# Altium schematic sheet digital_gpio.SchDoc
size 701 x 447 mm
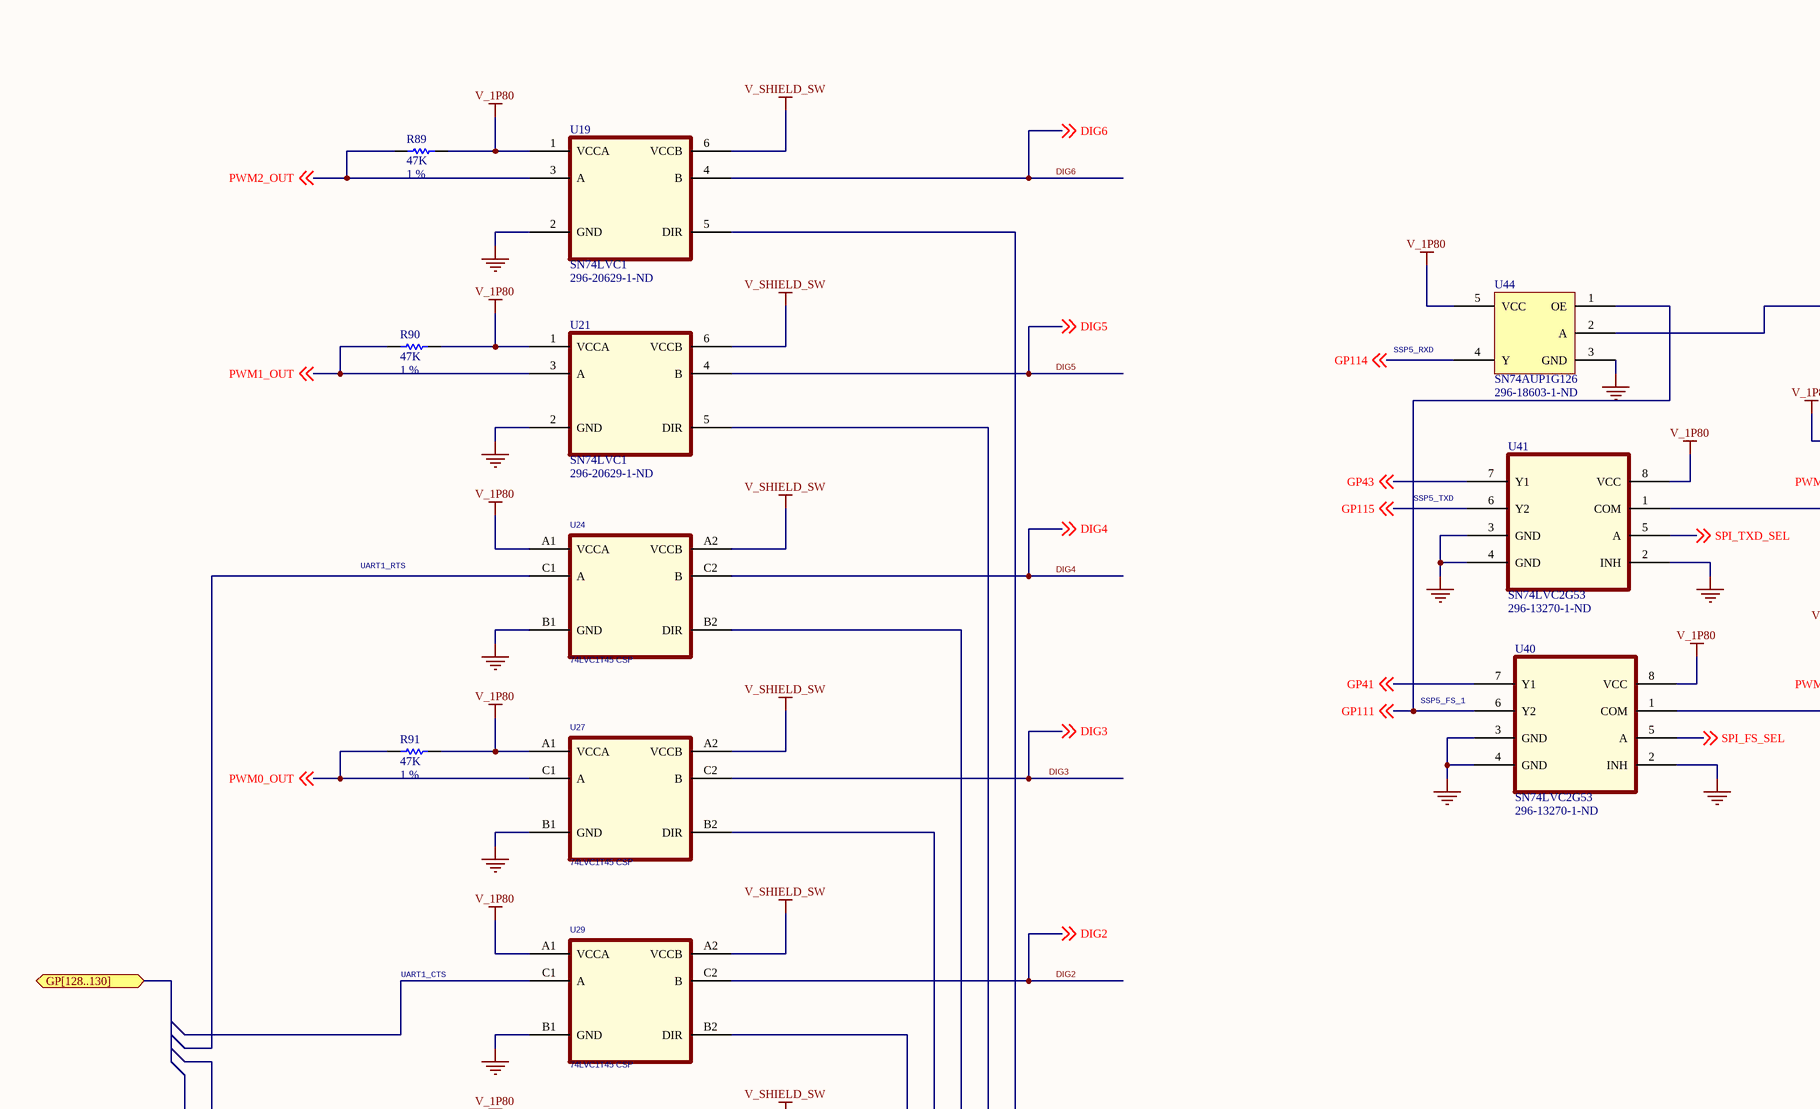
[diagram p0: digital_gpio.SchDoc, top left]
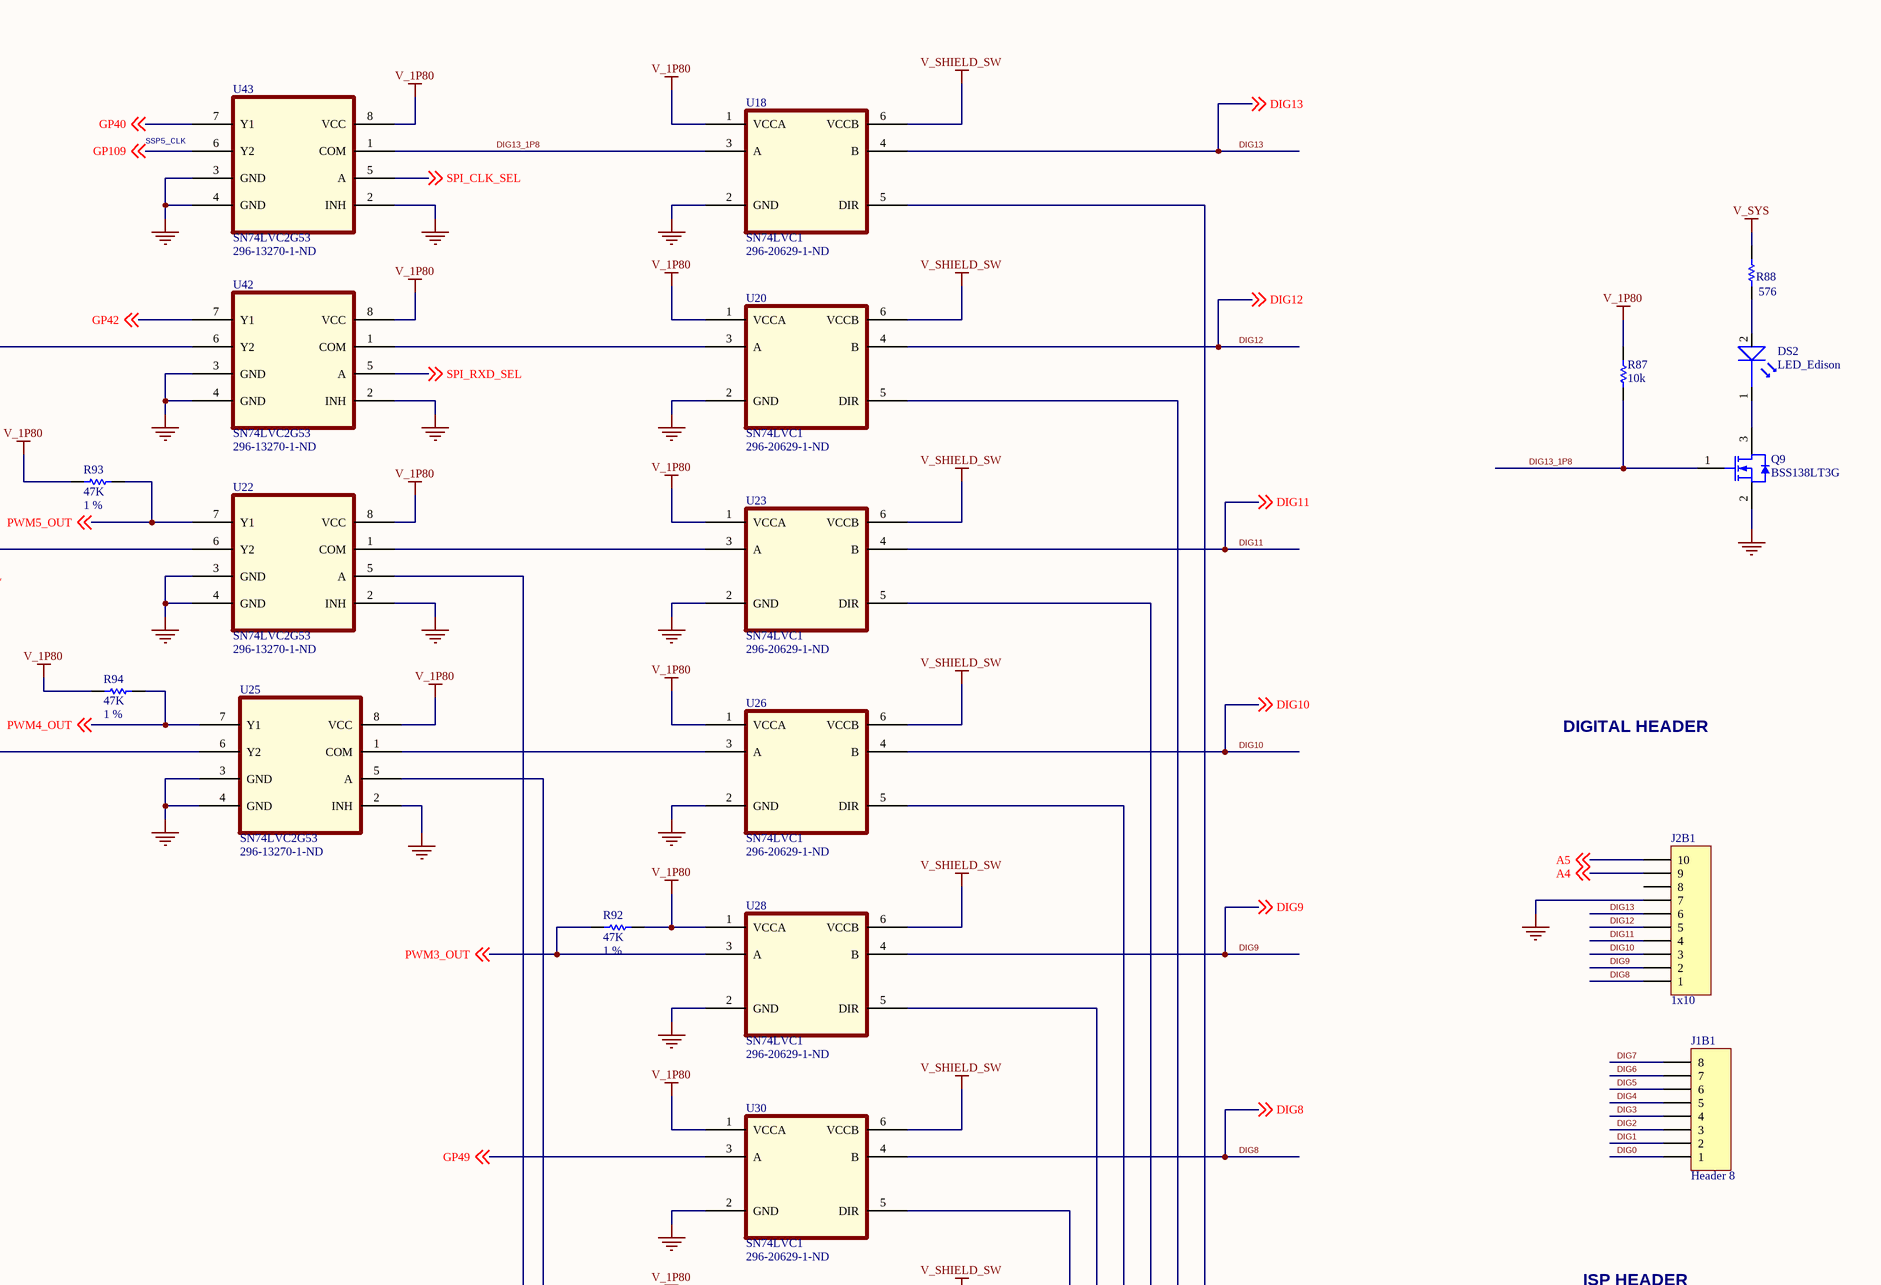
[diagram p1: digital_gpio.SchDoc, top right]
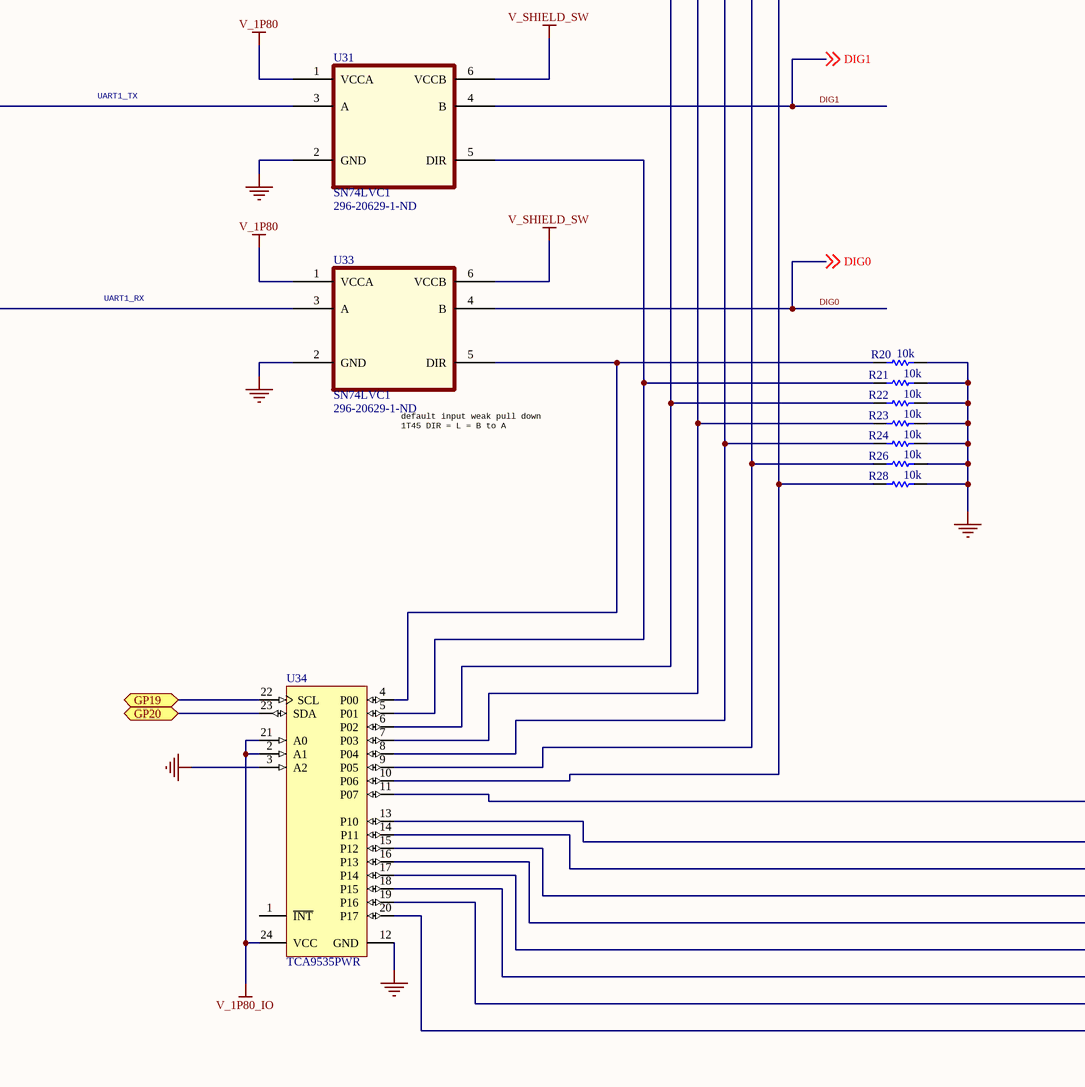
[diagram p2: digital_gpio.SchDoc, bottom left]
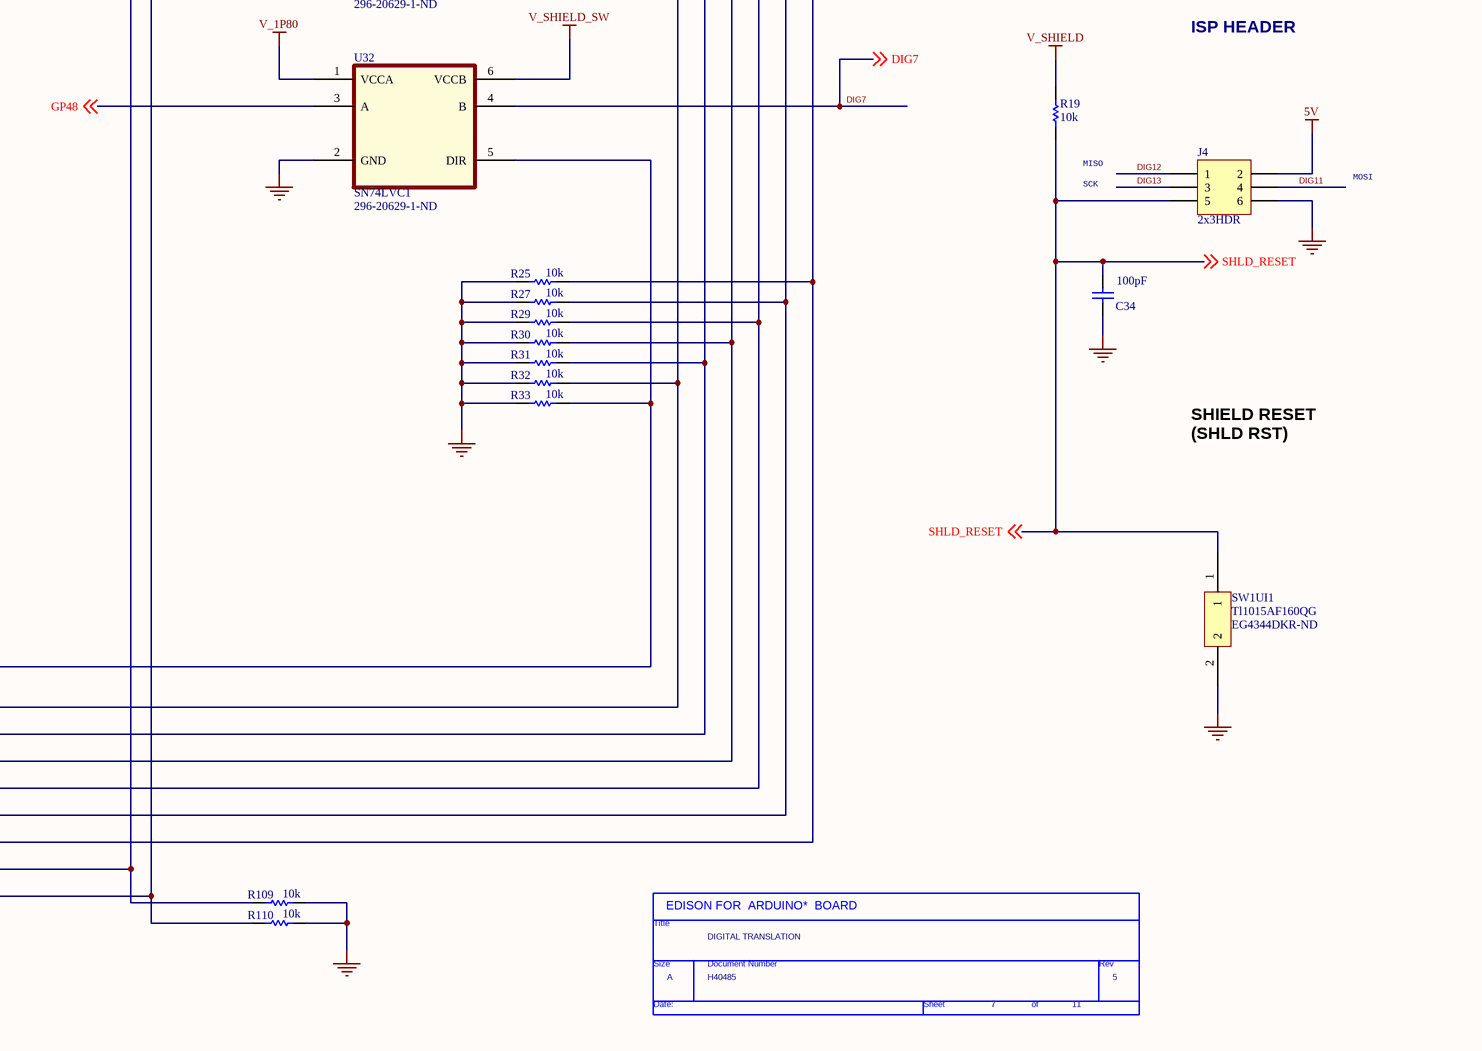
[diagram p3: digital_gpio.SchDoc, bottom right]

## Parts
*  Page Count: 11  Page Number: 7  Page Size: A  Title: DIGITAL TRANSLATION  RevCode: 5  Doc: H40485  (hidden comment: TitleBlock0)  (graphical)
C34  value 100pF  [CAPC0201(0603)33_N]  (hidden comment: CAP 100pF 25V 0201(0603))
DS2  LED_Edison  [LTST-C281KGKT]
J1B1  Header 8  [HDR1X8]
J2B1  1x10  [HDR1X10]
J4  2x3HDR  [HDR2X3]
Q9  BSS138LT3G  [ONSC-SOT-23-3-318-08_V]
R19  value 10k  [RESC0201(0603)_M]  (hidden comment: 165R 1% 0201(0603))
R20  value 10k  [RESC0201(0603)_M]  (hidden comment: 165R 1% 0201(0603))
R21  value 10k  [RESC0201(0603)_M]  (hidden comment: 165R 1% 0201(0603))
R22  value 10k  [RESC0201(0603)_M]  (hidden comment: 165R 1% 0201(0603))
R23  value 10k  [RESC0201(0603)_M]  (hidden comment: 165R 1% 0201(0603))
R24  value 10k  [RESC0201(0603)_M]  (hidden comment: 165R 1% 0201(0603))
R25  value 10k  [RESC0201(0603)_M]  (hidden comment: 165R 1% 0201(0603))
R26  value 10k  [RESC0201(0603)_M]  (hidden comment: 165R 1% 0201(0603))
R27  value 10k  [RESC0201(0603)_M]  (hidden comment: 165R 1% 0201(0603))
R28  value 10k  [RESC0201(0603)_M]  (hidden comment: 165R 1% 0201(0603))
R29  value 10k  [RESC0201(0603)_M]  (hidden comment: 165R 1% 0201(0603))
R30  value 10k  [RESC0201(0603)_M]  (hidden comment: 165R 1% 0201(0603))
R31  value 10k  [RESC0201(0603)_M]  (hidden comment: 165R 1% 0201(0603))
R32  value 10k  [RESC0201(0603)_M]  (hidden comment: 165R 1% 0201(0603))
R33  value 10k  [RESC0201(0603)_M]  (hidden comment: 165R 1% 0201(0603))
R87  value 10k  [RESC0201(0603)_M]  (hidden comment: 165R 1% 0201(0603))
R88  value 576  [RESC0402(1005)_L]  (hidden comment: 576R 1% 0402(1005))
R89  value 47K  Tolerance: 1 %  [RESC0201(0603)_N]  (hidden comment: 47K 1% 0201(0603))
R90  value 47K  Tolerance: 1 %  [RESC0201(0603)_N]  (hidden comment: 47K 1% 0201(0603))
R91  value 47K  Tolerance: 1 %  [RESC0201(0603)_N]  (hidden comment: 47K 1% 0201(0603))
R92  value 47K  Tolerance: 1 %  [RESC0201(0603)_N]  (hidden comment: 47K 1% 0201(0603))
R93  value 47K  Tolerance: 1 %  [RESC0201(0603)_N]  (hidden comment: 47K 1% 0201(0603))
R94  value 47K  Tolerance: 1 %  [RESC0201(0603)_N]  (hidden comment: 47K 1% 0201(0603))
R109  value 10k  [RESC0201(0603)_M]  (hidden comment: 165R 1% 0201(0603))
R110  value 10k  [RESC0201(0603)_M]  (hidden comment: 165R 1% 0201(0603))
SW1UI1  Tl1015AF160QG  Supplier Part Number 1: EG4344DKR-ND  [TL1015AF160QG]
U18  SN74LVC1  Supplier Part Number 1: 296-20629-1-ND  [R-PDSO-N6]
U19  SN74LVC1  Supplier Part Number 1: 296-20629-1-ND  [R-PDSO-N6]
U20  SN74LVC1  Supplier Part Number 1: 296-20629-1-ND  [R-PDSO-N6]
U21  SN74LVC1  Supplier Part Number 1: 296-20629-1-ND  [R-PDSO-N6]
U22  SN74LVC2G53  Supplier Part Number 1: 296-13270-1-ND  [S-PSDO-8]
U23  SN74LVC1  Supplier Part Number 1: 296-20629-1-ND  [R-PDSO-N6]
U24  74LVC1T45 CSP  [bga6_5mm_37x57]
U25  SN74LVC2G53  Supplier Part Number 1: 296-13270-1-ND  [S-PSDO-8]
U26  SN74LVC1  Supplier Part Number 1: 296-20629-1-ND  [R-PDSO-N6]
U27  74LVC1T45 CSP  [bga6_5mm_37x57]
U28  SN74LVC1  Supplier Part Number 1: 296-20629-1-ND  [R-PDSO-N6]
U29  74LVC1T45 CSP  [bga6_5mm_37x57]
U30  SN74LVC1  Supplier Part Number 1: 296-20629-1-ND  [R-PDSO-N6]
U31  SN74LVC1  Supplier Part Number 1: 296-20629-1-ND  [R-PDSO-N6]
U32  SN74LVC1  Supplier Part Number 1: 296-20629-1-ND  [R-PDSO-N6]
U33  SN74LVC1  Supplier Part Number 1: 296-20629-1-ND  [R-PDSO-N6]
U34  TCA9535PWR  [PW24_N]
U40  SN74LVC2G53  Supplier Part Number 1: 296-13270-1-ND  [S-PSDO-8]
U41  SN74LVC2G53  Supplier Part Number 1: 296-13270-1-ND  [S-PSDO-8]
U42  SN74LVC2G53  Supplier Part Number 1: 296-13270-1-ND  [S-PSDO-8]
U43  SN74LVC2G53  Supplier Part Number 1: 296-13270-1-ND  [S-PSDO-8]
U44  SN74AUP1G126  Supplier Part Number 1: 296-18603-1-ND  [R-PDS-N5]

## Ports
GP19 (bidir), GP20 (bidir), GP[128..130] (bidir)

## Nets
5V: J4.2
GND: C34.2 J2B1.7 J4.6 Q9.2(S) R20.1 R21.1 R22.1 R23.1 R24.1 R25.2 R26.1 R27.2 R28.1 R29.2 R30.2 R31.2 R32.2 R33.2 R109.1 R110.1 SW1UI1.2 U18.2(GND) U19.2(GND) U20.2(GND) U21.2(GND) U22.2(INH) U22.3(GND) U22.4(GND) U23.2(GND) U24.B1(GND) U25.2(INH) U25.3(GND) U25.4(GND) U26.2(GND) U27.B1(GND) U28.2(GND) U29.B1(GND) U30.2(GND) U31.2(GND) U32.2(GND) U33.2(GND) U34.3(A2) U34.12(GND) U40.2(INH) U40.3(GND) U40.4(GND) U41.2(INH) U41.3(GND) U41.4(GND) U42.2(INH) U42.3(GND) U42.4(GND) U43.2(INH) U43.3(GND) U43.4(GND) U44.3(GND)
V_1P80: R87.1 R89.1 R90.1 R91.1 R92.1 R93.2 R94.2 U18.1(VCCA) U19.1(VCCA) U20.1(VCCA) U21.1(VCCA) U22.8(VCC) U23.1(VCCA) U24.A1(VCCA) U25.8(VCC) U26.1(VCCA) U27.A1(VCCA) U28.1(VCCA) U29.A1(VCCA) U30.1(VCCA) U31.1(VCCA) U32.1(VCCA) U33.1(VCCA) U40.8(VCC) U41.8(VCC) U42.8(VCC) U43.8(VCC) U44.5(VCC)
V_1P80_IO: U34.2(A1) U34.21(A0) U34.24(VCC)
V_SHIELD: R19.1
V_SHIELD_SW: U18.6(VCCB) U19.6(VCCB) U20.6(VCCB) U21.6(VCCB) U23.6(VCCB) U24.A2(VCCB) U26.6(VCCB) U27.A2(VCCB) U28.6(VCCB) U29.A2(VCCB) U30.6(VCCB) U31.6(VCCB) U32.6(VCCB) U33.6(VCCB)
V_SYS: R88.2
A4: J2B1.9 ; off-sheet A4
A5: J2B1.10 ; off-sheet A5
DIG0: J1B1.1 U33.4(B) ; off-sheet DIG0
DIG1: J1B1.2 U31.4(B) ; off-sheet DIG1
DIG2: J1B1.3 U29.C2(B) ; off-sheet DIG2
DIG3: J1B1.4 U27.C2(B) ; off-sheet DIG3
DIG4: J1B1.5 U24.C2(B) ; off-sheet DIG4
DIG5: J1B1.6 U21.4(B) ; off-sheet DIG5
DIG6: J1B1.7 U19.4(B) ; off-sheet DIG6
DIG7: J1B1.8 U32.4(B) ; off-sheet DIG7
DIG8: J2B1.1 U30.4(B) ; off-sheet DIG8
DIG9: J2B1.2 U28.4(B) ; off-sheet DIG9
DIG10: J2B1.3 U26.4(B) ; off-sheet DIG10
DIG11: J2B1.4 J4.4 U23.4(B) ; off-sheet DIG11
DIG12: J2B1.5 J4.1 U20.4(B) ; off-sheet DIG12
DIG13: J2B1.6 J4.3 U18.4(B) ; off-sheet DIG13
DIG13_1P8: Q9.1(G) R87.2 U18.3(A) U43.1(COM)
GP19: U34.22(SCL) ; port GP19
GP20: U34.23(SDA) ; port GP20
GP40: U43.7(Y1) ; off-sheet GP40
GP41: U40.7(Y1) ; off-sheet GP41
GP42: U42.7(Y1) ; off-sheet GP42
GP43: U41.7(Y1) ; off-sheet GP43
GP48: U32.3(A) ; off-sheet GP48
GP49: U30.3(A) ; off-sheet GP49
GP109: U43.6(Y2) ; off-sheet GP109
GP111: U40.6(Y2) U44.1(OE) ; off-sheet GP111
GP114: U44.4(Y) ; off-sheet GP114
GP115: U41.6(Y2) ; off-sheet GP115
PWM0_OUT: R91.2 U27.C1(A) ; off-sheet PWM0_OUT
PWM1_OUT: R90.2 U21.3(A) ; off-sheet PWM1_OUT
PWM2_OUT: R89.2 U19.3(A) ; off-sheet PWM2_OUT
PWM3_OUT: R92.2 U28.3(A) ; off-sheet PWM3_OUT
PWM4_OUT: R94.1 U25.7(Y1) ; off-sheet PWM4_OUT
PWM5_OUT: R93.1 U22.7(Y1) ; off-sheet PWM5_OUT
SHLD_RESET: C34.1 J4.5 R19.2 SW1UI1.1 ; off-sheet SHLD_RESET
SPI_CLK_SEL: U43.5(A) ; off-sheet SPI_CLK_SEL
SPI_FS_SEL: U40.5(A) ; off-sheet SPI_FS_SEL
SPI_RXD_SEL: U42.5(A) ; off-sheet SPI_RXD_SEL
SPI_TXD_SEL: U41.5(A) ; off-sheet SPI_TXD_SEL
NetDS2_1: DS2.1(LED1) Q9.3(D)
NetDS2_2: DS2.2(LED2) R88.1
NetR20_2: R20.2 U33.5(DIR) U34.4(P00)
NetR21_2: R21.2 U31.5(DIR) U34.5(P01)
NetR22_2: R22.2 U29.B2(DIR) U34.6(P02)
NetR23_2: R23.2 U27.B2(DIR) U34.7(P03)
NetR24_2: R24.2 U24.B2(DIR) U34.8(P04)
NetR25_1: R25.1 U18.5(DIR) U34.18(P15)
NetR26_2: R26.2 U21.5(DIR) U34.9(P05)
NetR27_1: R27.1 U20.5(DIR) U34.17(P14)
NetR28_2: R28.2 U19.5(DIR) U34.10(P06)
NetR29_1: R29.1 U23.5(DIR) U34.16(P13)
NetR30_1: R30.1 U26.5(DIR) U34.15(P12)
NetR31_1: R31.1 U28.5(DIR) U34.14(P11)
NetR32_1: R32.1 U30.5(DIR) U34.13(P10)
NetR33_1: R33.1 U32.5(DIR) U34.11(P07)
NetR109_2: R109.2 U22.5(A) U34.19(P16)
NetR110_2: R110.2 U25.5(A) U34.20(P17)
NetU20_3: U20.3(A) U42.1(COM)
NetU22_1: U22.1(COM) U23.3(A)
NetU22_6: U22.6(Y2) U41.1(COM)
NetU25_1: U25.1(COM) U26.3(A)
NetU25_6: U25.6(Y2) U40.1(COM)
NetU42_6: U42.6(Y2) U44.2(A)

Not connected (* = marked no-connect by the designer): J2B1 8; U24 C1(A); U29 C1(A); U31 3(A); U33 3(A); U34 1(~{INT})

## Notes on the sheet
- (near U43) SSP5_CLK
- SSP5_RXD
- SSP5_TXD
- UART1_RTS
- DIGITAL HEADER
- SSP5_FS_1
- UART1_CTS
- UART1_TX
- ISP HEADER
- UART1_RX
- (near R19) MISO
- SCK
- MOSI
- (near U33) default input weak pull down
  1T45 DIR = L = B to A
- SHIELD RESET
  (SHLD RST)
- (in symbol TitleBlock0) EDISON FOR  ARDUINO*  BOARD; Title; Size; Document Number; Rev; Date:; Sheet; of

## Library data of the parts
C34 = CMP-1033-00493-1: CAP 100pF 25V ±5% 0201 (0603 Metric) Thickness 0.33mm SMD; Case-EIA: 0201; Case-Metric: 0603; Tolerance: ±5%; Rated Voltage: 25 V; Max Thickness: 0.33 mm; Technology: SMT; Supplier 1: Digi-Key; Supplier Part Number 1: 1276-1385-1-ND
J1B1 = Header 8: Header, 8-Pin; LatestRevisionDate: 17-Jul-2002; LatestRevisionNote: Re-released for DXP Platform.; Publisher: Altium Limited; Supplier 1: Digi-Key; Supplier Part Number 1: S7006-ND
J2B1 = Header 10: Header, 10-Pin; LatestRevisionDate: 17-Jul-2002; LatestRevisionNote: Re-released for DXP Platform.; Publisher: Altium Limited; Supplier 1: Digi-Key; Supplier Part Number 1: S7008-ND
J4 = Header 3X2: Header, 3-Pin, Dual row; LatestRevisionDate: 17-Jul-2002; LatestRevisionNote: Re-released for DXP Platform.; Publisher: Altium Limited
Q9 = CMP-1058-00765-1: Power MOSFET, 200 mA, 50 V, N-Channel, 3-Pin SOT-23, Pb-Free, Tape and Reel; Manufacturer: On Semiconductor; PD Max (W): 0.225; Channel Polarity: N Channel; Crss Typ (pF): 3.5; Configuration: Single; ID Max (A): 0.2; Ciss Typ (pF): 40; V(BR)DSS Min (V): 50; VGS(th) Max (V): 1.5; Coss Typ (pF): 12; VGS Max (V): 20; ComponentLink2URL: http://www.onsemi.com/pub_link/Collateral/BSS138LT1-D.PDF; PackageDescription: 3-Pin Small Outline Transistor, Body 2.92 x 1.3 mm, Pitch 0.95 mm; Package Type: SOT-23-3; Mounting Technology: Surface Mount; ComponentLink1Description: Manufacturer URL; PackageVersion: Rev. AP, 11/2009; ComponentLink3Description: Package Specification; DatasheetVersion: Rev. 8; RoHS: Pb-Free; Packing: Tape and Reel; PackageReference: SOT-23-3-318-08; PartNumber: BSS138LT3G; ComponentLink3URL: http://www.onsemi.cn/pub_link/Collateral/318-08.PDF; ComponentLink1URL: http://www.onsemi.com/; ComponentLink2Description: Datasheet
R19-R33 R87 R109 R110 = CMP-1010-00326-1: 165R 0.05W 1% 0201 (0603 Metric)  SMD; Case-EIA: 0201; Case-Metric: 0603; Power: 0.05 W; Tolerance: 1 %; Technology: SMT; Supplier 1: Digi-Key; Supplier Part Number 1: 311-165HRCT-ND
R88 = CMP-1011-00483-1: 576R 0.063W 1% 0402 (1005 Metric)  SMD; Case-Metric: 1005; Case-EIA: 0402; Technology: SMT; Tolerance: 1 %; Power: 0.063 W; Supplier 1: Mouser; Supplier Part Number 1: 660-RK73H1ETTP5760F
R89-R94 = CMP-1010-00605-1: 47K 0.05W 1% 0201 (0603 Metric)  SMD; Case-EIA: 0201; Case-Metric: 0603; Technology: SMT; Power: 0.05 W; Supplier 1: Digi-Key; Supplier Part Number 1: 311-47KMCT-ND
U24 U27 U29 = IC,74LVC1T45,LOG,BGA6,TRNSSVR: IC,LOG,TRANSCEIVE,CSP,SN74LVC1T45,NI3S,; FINANCE: x; LEAD_FREE: YES; IPN: G42189-001; NO_STUFF: .; MFG: TI; MFG P/N: 74LVC1T45YZPR; BOM: x; DEVICE: G42189-001; PART_NUMBER: G42189-001
U34 = CMP-0314-00245-1: Remote 16-Bit I2C and SMBus, Low-Power I/O Expander with Interrupt Output and Config Register, 1.65 to 5.5 V, -40 to 85 degC, 24-pin TSSOP (PW), Green (RoHS & no Sb/Br); Manufacturer: Texas Instruments; SubFamily: I2C IO Expander; Configuration Registers: Yes; Max Frequency(kHz): 400; # of I/Os: 16; I2C Address: 0100 xxx; Code_JEDEC: MO-153; Vcc range(V): 1.65 to 5.5; PackageReference: PW24; ComponentLink2Description: Package Specification; ComponentLink1Description: Datasheet; PartNumber: TCA9535PWR; PackageVersion: revG, Feb-2011; Interrupt Output: Yes; ComponentLink2URL: http://www.ti.com/litv/pdf/mpds177g; Eco-Plan: Green (RoHS & no Sb/Br); ComponentLink1URL: http://www.ti.com/general/docs/lit/getliterature.tsp?genericPartNumber=TCA9535&fileType=pdf; Low Power: Yes; PackageDescription: 24-Pin Thin Small Outline Package 0.65 mm Pitch; DatasheetVersion: SCPS201A; Push-Pull I/O Type: Yes; Mounting Technology: Surface Mount; 5V Tolerant I/O: Yes
* = TitleBlock0: Page Create Date: March  8, 1995
DS2 = LED_Edison: Supplier 1: Mouser; Supplier Part Number 1: 859-LTST-C281KGKT
SW1UI1 = Tl1015AF160QG: Supplier 1: Digi-Key
U18-U21 U23 U26 U28 U30-U33 = SN74LVC1: Supplier 1: Digi-Key
U22 U25 U40-U43 = SN74LVC2G53: Supplier 1: Digi-Key
U44 = SN74AUP1G126: Supplier 1: Digi-Key